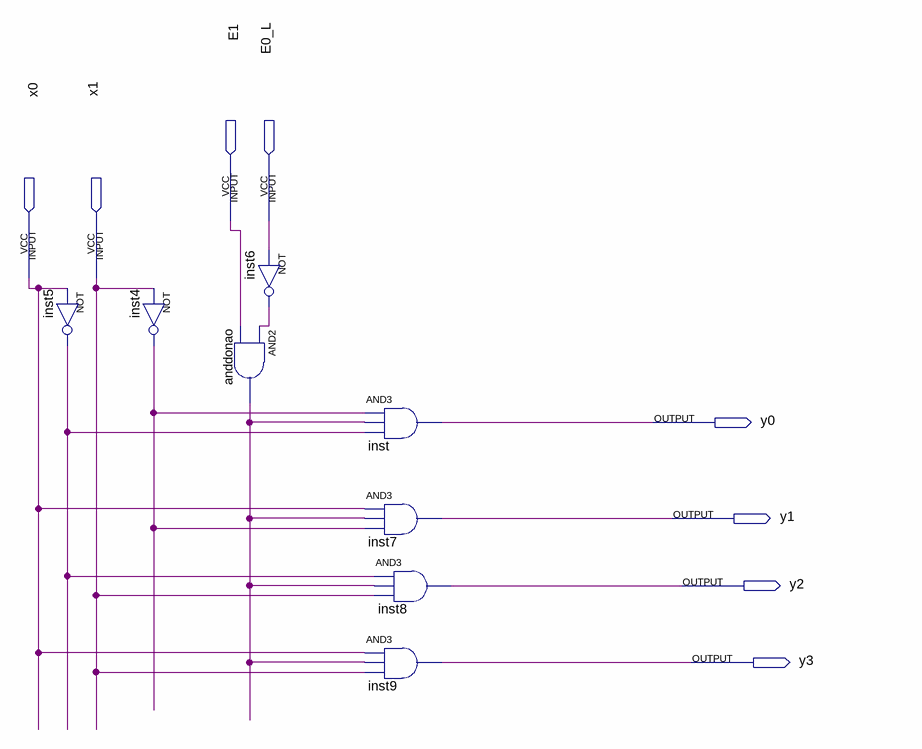
[diagram p0: schematic sheet]
// Quartus schematic Estudar.bdf as structural Verilog: 8 symbols, 8 pins
module Estudar (
  input  E1,
  input  E0_L,
  input  x0,
  input  x1,
  output y0,
  output y1,
  output y2,
  output y3
);

  wire anddonao_out, inst4_out, inst5_out, inst6_out;

  not inst5 (inst5_out, x0);
  not inst4 (inst4_out, x1);
  not inst6 (inst6_out, E0_L);
  and anddonao (anddonao_out, inst6_out, E1);
  and inst (y0, inst4_out, anddonao_out, inst5_out);
  and inst7 (y1, x0, anddonao_out, inst4_out);
  and inst8 (y2, inst5_out, anddonao_out, x1);
  and inst9 (y3, x0, anddonao_out, x1);
endmodule
